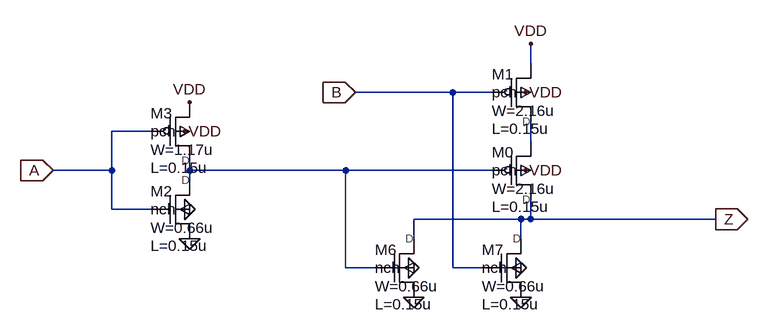
[diagram p0: schematic NOR.asc]
NOR.asc, the LTspice schematic file:
Version 4.1
SHEET 1 2000 1000
WIRE 1590 -1290 1590 -1320
WIRE 1470 -1245 1320 -1245
WIRE 1530 -1245 1470 -1245
WIRE 1005 -1185 945 -1185
WIRE 1057 -1185 1050 -1185
WIRE 1590 -1170 1590 -1200
WIRE 945 -1125 945 -1185
WIRE 945 -1125 855 -1125
WIRE 1065 -1125 1065 -1140
WIRE 1305 -1125 1065 -1125
WIRE 1530 -1125 1305 -1125
WIRE 1582 -1125 1575 -1125
WIRE 1065 -1110 1065 -1125
WIRE 945 -1065 945 -1125
WIRE 1005 -1065 945 -1065
WIRE 1057 -1065 1050 -1065
WIRE 1575 -1050 1410 -1050
WIRE 1590 -1050 1590 -1080
WIRE 1590 -1050 1575 -1050
WIRE 1875 -1050 1590 -1050
WIRE 1410 -1020 1410 -1050
WIRE 1575 -1020 1575 -1050
WIRE 1305 -975 1305 -1125
WIRE 1350 -975 1305 -975
WIRE 1402 -975 1380 -975
WIRE 1470 -975 1470 -1245
WIRE 1515 -975 1470 -975
WIRE 1567 -975 1545 -975
FLAG 1582 -1125 VDD
FLAG 1582 -1245 VDD
FLAG 1057 -1185 VDD
FLAG 1575 -930 0
FLAG 1410 -930 0
FLAG 1065 -1020 0
FLAG 1590 -1320 VDD
FLAG 1065 -1230 VDD
FLAG 1402 -975 0
FLAG 1567 -975 0
FLAG 1057 -1065 0
FLAG 855 -1125 A
IOPIN 855 -1125 In
FLAG 1875 -1050 Z
IOPIN 1875 -1050 Out
FLAG 1320 -1245 B
IOPIN 1320 -1245 In
SYMBOL pch 1530 -1125 R0
WINDOW 0 0 -28 Left 2
WINDOW 38 0 0 Left 2
WINDOW 3 0 28 Left 2
WINDOW 123 0 56 Left 2
SYMATTR InstName M0
SYMATTR Value W=2.16u
SYMATTR Value2 L=0.15u
SYMBOL pch 1530 -1245 R0
WINDOW 0 0 -28 Left 2
WINDOW 38 0 0 Left 2
WINDOW 3 0 28 Left 2
WINDOW 123 0 56 Left 2
SYMATTR InstName M1
SYMATTR Value W=2.16u
SYMATTR Value2 L=0.15u
SYMBOL pch 1005 -1185 R0
WINDOW 0 0 -28 Left 2
WINDOW 38 0 0 Left 2
WINDOW 3 0 28 Left 2
WINDOW 123 0 56 Left 2
SYMATTR InstName M3
SYMATTR Value W=1.17u
SYMATTR Value2 L=0.15u
SYMBOL nch 1350 -975 R0
WINDOW 0 0 -28 Left 2
WINDOW 38 0 0 Left 2
WINDOW 3 0 28 Left 2
WINDOW 123 0 56 Left 2
SYMATTR InstName M6
SYMATTR Value W=0.66u
SYMATTR Value2 L=0.15u
SYMBOL nch 1515 -975 R0
WINDOW 0 0 -28 Left 2
WINDOW 38 0 0 Left 2
WINDOW 3 0 28 Left 2
WINDOW 123 0 56 Left 2
SYMATTR InstName M7
SYMATTR Value W=0.66u
SYMATTR Value2 L=0.15u
SYMBOL nch 1005 -1065 R0
WINDOW 0 0 -28 Left 2
WINDOW 38 0 0 Left 2
WINDOW 3 0 28 Left 2
WINDOW 123 0 56 Left 2
SYMATTR InstName M2
SYMATTR Value W=0.66u
SYMATTR Value2 L=0.15u

The netlist it stands for:
* NOR.asc
M0 Z N002 N001 VDD pch W=2.16u L=0.15u
M1 N001 B VDD VDD pch W=2.16u L=0.15u
M3 N002 A VDD VDD pch W=1.17u L=0.15u
M6 Z N002 0 0 nch W=0.66u L=0.15u
M7 Z B 0 0 nch W=0.66u L=0.15u
M2 N002 A 0 0 nch W=0.66u L=0.15u
.model NMOS NMOS
.model PMOS PMOS
.lib standard.mos
.backanno
.end